# EAGLE schematic Synth_SCG_HAT (EAGLE 9.6.2)
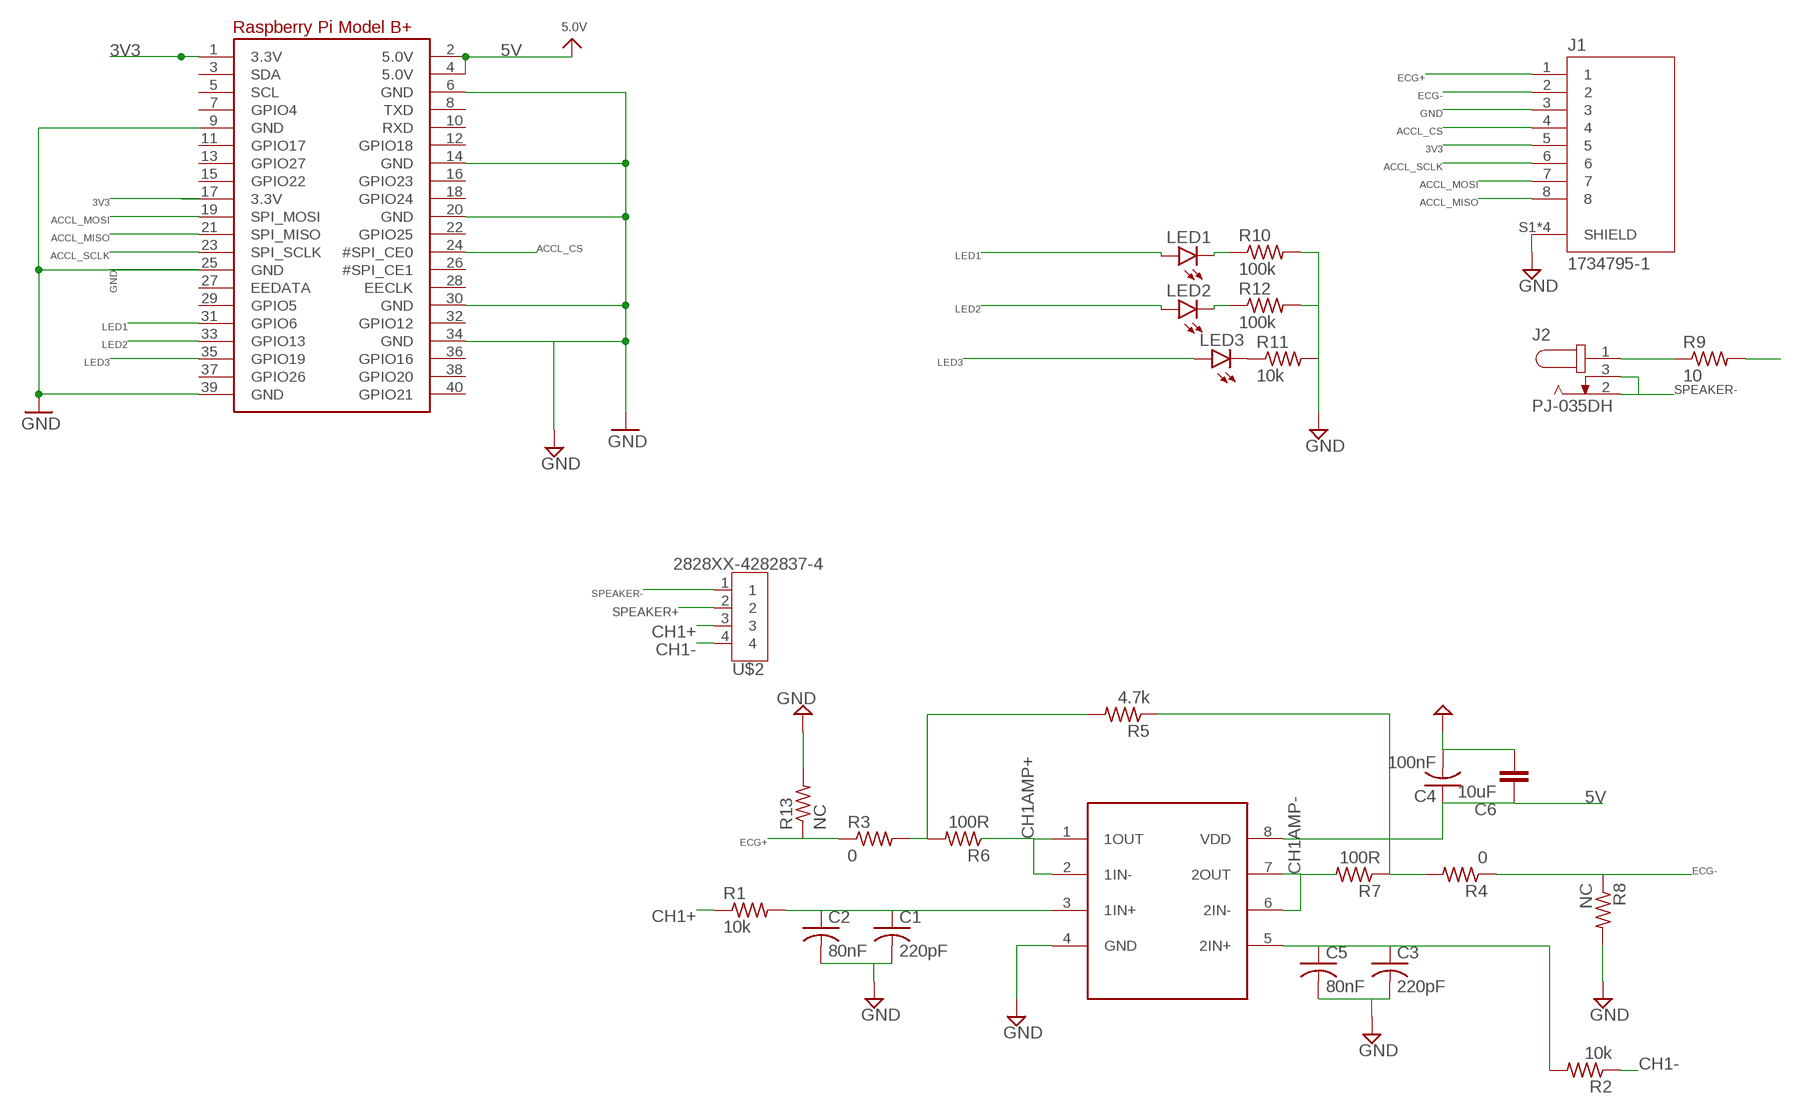
[diagram p0: schematic, sheet 1]

## Parts
C1  220pF  C-US_CHIP-1206(3216-METRIC)  [CAPC3216X135]
C2  80nF  C-US_CHIP-0805(2012-METRIC)  [CAPC2012X110]
C3  220pF  C-US_CHIP-1206(3216-METRIC)  [CAPC3216X135]
C4  100nF  C-US_CHIP-0603(1608-METRIC)  [CAPC1608X85]
C5  80nF  C-US_CHIP-0805(2012-METRIC)  [CAPC2012X110]
C6  10uF  C_TANTALUM-1206(3216-METRIC)  [CAPM3216X180]
J1  1734795-1  [TE_1734795-1]
J2  PJ-035DH  [CUI_PJ-035DH]
LED1  LEDCHIPLED_1206  [CHIPLED_1206]
LED2  LEDCHIPLED_1206  [CHIPLED_1206]
LED3  LEDCHIPLED_1206  [CHIPLED_1206]
R1  10k  R-US_R0603  [R0603]
R2  10k  R-US_R0603  [R0603]
R3  0  R-US_R0603  [R0603]
R4  0  R-US_R0603  [R0603]
R5  4.7k  R-US_R0603  [R0603]
R6  100R  R-US_R0603  [R0603]
R7  100R  R-US_R0603  [R0603]
R8  NC  R-US_R0603  [R0603]
R9  10  R-US_R0603  [R0603]
R10  100k  R-US_R0603  [R0603]
R11  10k  R-US_R0603  [R0603]
R12  100k  R-US_R0603  [R0603]
R13  NC  R-US_R0603  [R0603]
RPI1  RASPBERRYPI_BPLUS_BONNETNODIM  [PI_BONNET_NODIM]
U$1  TLV4112  [DIP794W45P254L959H508Q8]
U$2  2828XX-4282837-4  [TERMBLK_508-4N]

## Nets
3.3V@1: RPI1.17(3.3V)
3V3: J1.5 RPI1.1(3.3V)
5V: C4.1 C6.1 RPI1.2(5.0V) RPI1.4(5.0V) U$1.8(VDD) ; supply symbol labelled 5.0V
ACCL_CS: J1.4 RPI1.24(#SPI_CE0)
ACCL_MISO: J1.8 RPI1.21(SPI_MISO)
ACCL_MOSI: J1.7 RPI1.19(SPI_MOSI)
ACCL_SCLK: J1.6 RPI1.23(SPI_SCLK)
CH1+: R1.1 U$2.3
CH1-: R2.1 U$2.4
CH1AMP+: R6.1 U$1.1(1OUT) U$1.2(1IN-)
CH1AMP-: R7.2 U$1.6(2IN-) U$1.7(2OUT)
ECG+: J1.1 R3.1 R13.1
ECG-: J1.2 R4.1 R8.1
GND: C1.2 C2.2 C3.2 C4.2 C5.2 C6.2 J1.3 J1.S1(SHIELD) J1.S2(SHIELD) J1.S3(SHIELD) J1.S4(SHIELD) R8.2 R10.2 R11.2 R12.2 R13.2 RPI1.6(GND) RPI1.9(GND) RPI1.14(GND) RPI1.20(GND) RPI1.25(GND) RPI1.30(GND) RPI1.34(GND) RPI1.39(GND) U$1.4(GND)
LED1: LED1.A RPI1.31(GPIO6)
LED2: LED2.A RPI1.33(GPIO13)
LED3: LED3.A RPI1.35(GPIO19)
N$1: C1.1 C2.1 R1.2 U$1.3(1IN+)
N$2: R3.2 R5.2 R6.2
N$3: C3.1 C5.1 R2.2 U$1.5(2IN+)
N$4: J2.1 R9.1
N$5: R4.2 R5.1 R7.1
N$9: LED3.C R11.1
N$11: LED2.C R12.1
N$14: LED1.C R10.1
SPEAKER+: R9.2 U$2.2
SPEAKER-: J2.2 J2.3 U$2.1
Unconnected: RPI1.3(SDA) RPI1.5(SCL) RPI1.7(GPIO4) RPI1.8(TXD) RPI1.10(RXD) RPI1.11(GPIO17) RPI1.12(GPIO18) RPI1.13(GPIO27) RPI1.15(GPIO22) RPI1.16(GPIO23) RPI1.18(GPIO24) RPI1.22(GPIO25) RPI1.26(#SPI_CE1) RPI1.27(EEDATA) RPI1.28(EECLK) RPI1.29(GPIO5) RPI1.32(GPIO12) RPI1.36(GPIO16) RPI1.37(GPIO26) RPI1.38(GPIO20) RPI1.40(GPIO21)

## Library data of the parts
C1-C5 = Capacitor:C-US: Capacitor - ANSI; CATEGORY: Capacitor
C6 = Capacitor:C: Capacitor - Generic; CATEGORY: Capacitor
J1 = SamacSys_Parts:1734795-1: RJ45,8P8C,SHD,W/O LED,DIP 6u" Check prices <https://pricing.snapeda.com/parts/1734795-1/TE%20Connectivity/view-part?ref=eda>; AVAILABILITY: In Stock; CENTERLINE_PITCH: 1.02 mm[.04 in]; COMMENT: 1734795-1; DESCRIPTION: RJ45,8P8C,SHD,W/O LED,DIP 6u; EU_ROHS_COMPLIANCE: Compliant; MF: TE Connectivity; MP: 1734795-1; NUMBER_OF_POSITIONS: 8; PACKAGE: None; PRICE: None; PURCHASE-URL: https://pricing.snapeda.com/search/part/1734795-1/?ref=eda
J2 = SamacSys_Parts:PJ-035DH: 1.3 mm Center Pin, 3.5 A, Right Angle, Through Hole, Dc Power Jack Connector Check prices <https://pricing.snapeda.com/parts/PJ-035DH/CUI%20Devices/view-part?ref=eda>; AVAILABILITY: Warning; CUI_PURCHASE_URL: https://www.cuidevices.com/product/interconnect/connectors/dc-power-connectors/jacks/pj-035dh?utm_source=snapeda.com&utm_medium=referral&utm_campaign=snapedaBOM; DESCRIPTION: 1.3 x 3.8 mm, 3.5 A, Horizontal, Through Hole, Dc Power Jack Connector; MF: CUI Devices; MP: PJ-035DH; PACKAGE: None; PRICE: None; PURCHASE-URL: https://pricing.snapeda.com/search/part/PJ-035DH/?ref=eda
LED1-LED3 = led:LED: LED OSRAM: - CHIPLED LG R971, LG N971, LY N971, LG Q971, LY Q971, LO R971, LY R971 LH N974, LH R974 LS Q976, LO Q976, LY Q976 LO Q996 - Hyper CHIPLED LW Q18S LB Q993, LB Q99A, LB R99A - SideLED LS A670, LO A670, LY A670, LG A670, LP A670 LB A673, LV A673, LT A673, LW A673 LH A674 LY A675 LS A676, LA A676, LO A676, LY A676, LW A676 LS A679, LY A679, LG A679 - Hyper Micro SIDELED® LS Y876, LA Y876, LO Y876, LY Y876 LT Y87S - SmartLED LW L88C, LW L88S LB L89C, LB L89S, LG L890 LS L89K, LO L89K, LY L89K LS L896, LA L896, LO L896, LY L896 - TOPLED LS T670, LO T670, LY T670, LG T670, LP T670 LSG T670, LSP T670, LSY T670, LOP T670, LYG T670 LG T671, LOG T671, LSG T671 LB T673, LV T673, LT T673, LW T673 LH T674 LS T676, LA T676, LO T676, LY T676, LB T676, LH T676, LSB T676, LW T676 LB T67C, LV T67C, LT T67C, LS T67K, LO T67K, LY T67K, LW E67C LS E67B, LA E67B, LO E67B, LY E67B, LB E67C, LV E67C, LT E67C LW T67C LS T679, LY T679, LG T679 LS T770, LO T770, LY T770, LG T770, LP T770 LB T773, LV T773, LT T773, LW T773 LH T774 LS E675, LA E675, LY E675, LS T675 LS T776, LA T776, LO T776, LY T776, LB T776 LHGB T686 LT T68C, LB T68C - Hyper Mini TOPLED® LB M676 - Mini TOPLED Santana® LG M470 LS M47K, LO M47K, LY M47K Source: http://www.osram.convergy.de LUXEON: - LUMILED® LXK2-PW12-R00, LXK2-PW12-S00, LXK2-PW14-U00, LXK2-PW14-V00 LXK2-PM12-R00, LXK2-PM12-S00, LXK2-PM14-U00 LXK2-PE12-Q00, LXK2-PE12-R00, LXK2-PE12-S00, LXK2-PE14-T00, LXK2-PE14-U00 LXK2-PB12-K00, LXK2-PB12-L00, LXK2-PB12-M00, LXK2-PB14-N00, LXK2-PB14-P00, LXK2-PB14-Q00 LXK2-PR12-L00, LXK2-PR12-M00, LXK2-PR14-Q00, LXK2-PR14-R00 LXK2-PD12-Q00, LXK2-PD12-R00, LXK2-PD12-S00 LXK2-PH12-R00, LXK2-PH12-S00 LXK2-PL12-P00, LXK2-PL12-Q00, LXK2-PL12-R00 Source: www.luxeon.com KINGBRIGHT: KA-3528ASYC Source: www.kingbright.com
R1-R13 = resistor:R-US_: RESISTOR, American symbol
RPI1 = microbuilder:RASPBERRYPI_BPLUS
U$1 = SamacSys_Parts:TLV4112
U$2 = Connector:2828XX-4: 4 Position Wire to Board Terminal Block Horizontal with Board Datasheet <https://www.te.com.cn/commerce/DocumentDelivery/DDEController?Action=showdoc&DocId=Catalog+Section%7F1308389_EUROSTYLE_TERMINAL_BLOCKS%7F0607%7Fpdf%7FEnglish%7FENG_CS_1308389_EUROSTYLE_TERMINAL_BLOCKS_0607.pdf%7F2-282837-5>; CATEGORY: Connector; DESCRIPTION: TERM BLK 4P SIDE ENT 5.08mm PCB; MANUFACTURER: TE Connectivity; MPN: 282837-4; OPERATING_TEMPERATURE: 40°C to +105°C; PART_STATUS: Active; ROHS_COMPLIANCE: RoHS Compliant; SERIES: 283737; SUBCATEGORY: Terminal Block; TYPE: Side Wire Entry